# EAGLE design au6850_mp3 (EAGLE 7.6.0)
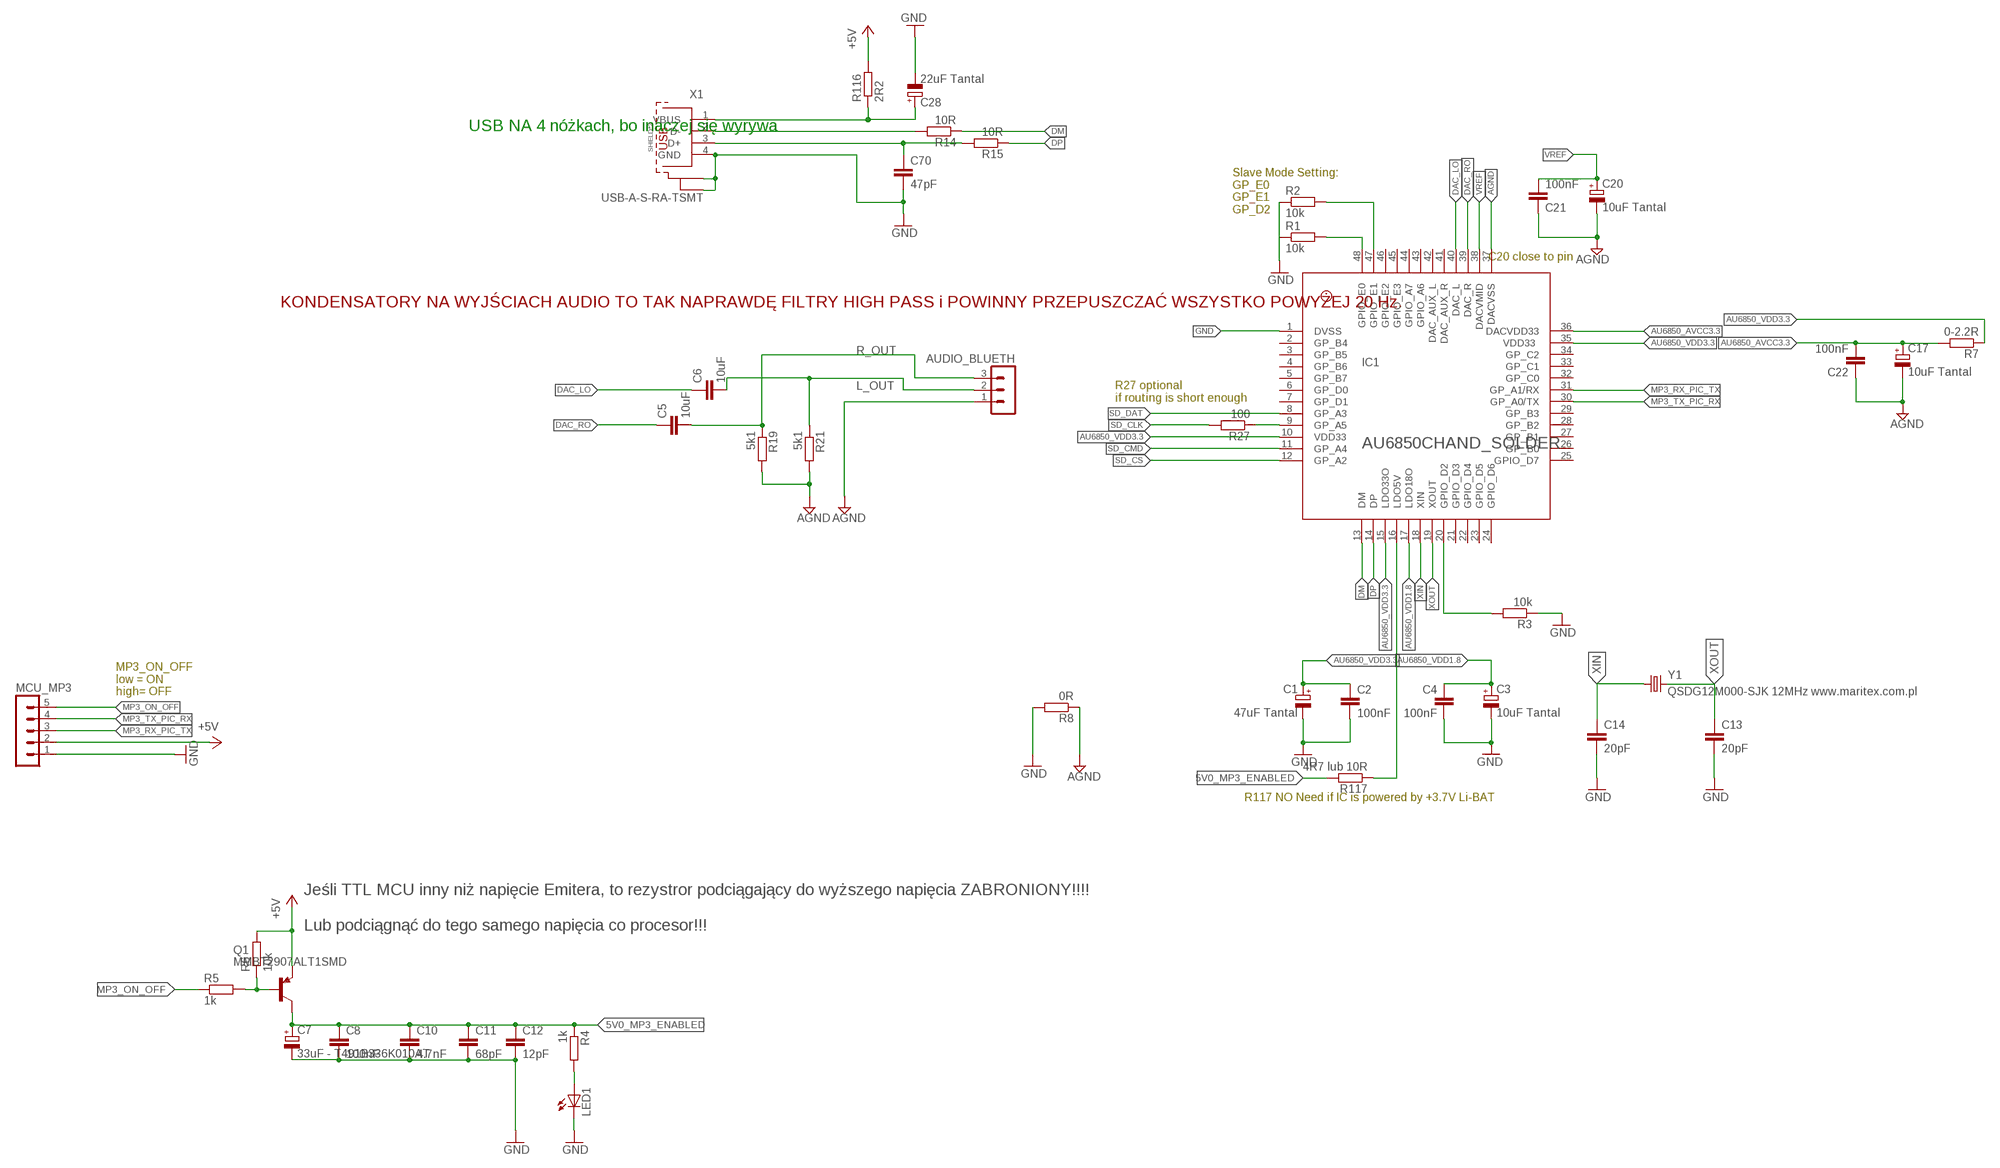
[diagram p0: schematic, sheet 1, part 1 of 2]
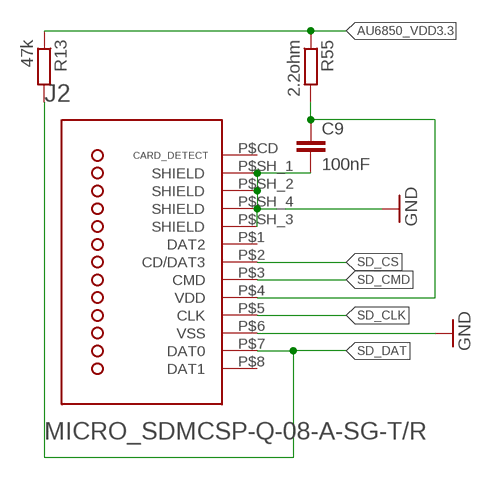
[diagram p1: schematic, sheet 1, part 2 of 2]

## Parts
AUDIO_BLUETH  MA03-1  [MA03-1]
C1  47uF Tantal  CPOL-EUB/3528-21R  [B/3528-21R]
C2  100nF  C-EUC0805  [C0805]
C3  10uF Tantal  CPOL-EUB/3528-21R  [B/3528-21R]
C4  100nF  C-EUC0805  [C0805]
C5  10uF  C-EUC0805  [C0805]
C6  10uF  C-EUC0805  [C0805]
C7  33uF - T491B336K010AT  CPOL-EUSMCB  [SMC_B]
C8  100nF  C-EUC0805  [C0805]
C9  100nF  C-EUC0805  [C0805]
C10  4.7nF  C-EUC0805  [C0805]
C11  68pF  C-EUC0805  [C0805]
C12  12pF  C-EUC0603K  [C0603K]
C13  20pF  C-EUC0805  [C0805]
C14  20pF  C-EUC0805  [C0805]
C17  10uF Tantal  CPOL-EUB/3528-21R  [B/3528-21R]
C20  10uF Tantal  CPOL-EUB/3528-21R  [B/3528-21R]
C21  100nF  C-EUC0805  [C0805]
C22  100nF  C-EUC0805  [C0805]
C28  22uF Tantal  CPOL-EUSMCB  [SMC_B]
C70  47pF  C-EUC0805  [C0805]
IC1  AU6850CHAND_SOLDER  [LQFP48-7X7_3MM]
J2  MICRO_SDMCSP-Q-08-A-SG-T/R  [MICRO_SD_8PINS]
LED1  LED3MM  [LED3MM]
MCU_MP3  MA05-1  [MA05-1]
Q1  MMBT2907ALT1SMD  [SOT23-BEC]
R1  10k  R-EU_R0805  [R0805]
R2  10k  R-EU_R0805  [R0805]
R3  10k  R-EU_R0805  [R0805]
R4  1k  R-EU_M0805  [M0805]
R5  1k  R-EU_M0805  [M0805]
R6  10k  R-EU_M0805  [M0805]
R7  0-2.2R  R-EU_R0805  [R0805]
R8  0R  R-EU_R0805  [R0805]
R13  47k  R-EU_R0805  [R0805]
R14  10R  R-EU_R0805  [R0805]
R15  10R  R-EU_R0805  [R0805]
R19  5k1  R-EU_R0805  [R0805]
R21  5k1  R-EU_R0805  [R0805]
R27  100  R-EU_R0805  [R0805]
R55  2.2ohm  R-EU_R0805  [R0805]
R116  2R2  R-EU_R0805  [R0805]
R117  4R7 lub 10R  R-EU_R0805  [R0805]
X1  USB-A-S-RA-TSMT  [USB-A-S-RA-TSMT]
Y1  QSDG12M000-SJK 12MHz www.maritex.com.pl  CRYSTALSMD  [HC49UP]

## Nets
5V0_MP3_ENABLED: C7.+ C8.1 C10.1 C11.1 C12.1 Q1.C R4.1 R117.2
+5V: MCU_MP3.2 Q1.E R6.2 R116.2
AGND: AUDIO_BLUETH.1 C17.- C20.- C21.1 C22.1 IC1.37(DACVSS) R8.1 R19.2 R21.2
AU6850_AVCC3.3: C17.+ C22.2 IC1.36(DACVDD33) R7.2
AU6850_VDD1.8: C3.+ C4.1 IC1.17(LDO18O)
AU6850_VDD3.3: C1.+ C2.1 IC1.10(VDD33) IC1.15(LDO33O) IC1.35(VDD33) R7.1 R13.1 R55.1
DAC_LO: C6.1 IC1.40(DAC_L)
DAC_RO: C5.1 IC1.39(DAC_R)
DM: IC1.13(DM) R14.1
DP: IC1.14(DP) R15.1
GND: C1.- C2.2 C3.- C4.2 C7.- C8.2 C9.2 C10.2 C11.2 C12.2 C13.2 C14.2 C28.- C70.2 IC1.1(DVSS) J2.P$6(VSS) J2.P$SH_1(1_GND_PAD) J2.P$SH_2(2_GND_PAD) J2.P$SH_3(3_GND_PAD) J2.P$SH_4(4_GND_PAD) LED1.K(C) MCU_MP3.1 R1.1 R2.1 R3.1 R8.2 X1.4(GND) X1.5(SH1) X1.6(SH2)
L_OUT: AUDIO_BLUETH.2 C6.2 R21.1
MP3_ON_OFF: MCU_MP3.5 R5.1
MP3_RX_PIC_TX: IC1.31(GP_A1/RX) MCU_MP3.3
MP3_TX_PIC_RX: IC1.30(GP_A0/TX) MCU_MP3.4
N$1: LED1.A R4.2
N$2: Q1.B R5.2 R6.1
N$4: IC1.16(LDO5V) R117.1
N$5: IC1.9(GP_A5) R27.1
N$8: C28.+ R116.1 X1.1(VBUS)
N$9: C70.1 R15.2 X1.3(D+)
N$10: R14.2 X1.2(D-)
N$14: C9.1 J2.P$4(VDD) R55.2
R_OUT: AUDIO_BLUETH.3 C5.2 R19.1
SD_CLK: J2.P$5(CLK) R27.2
SD_CMD: IC1.11(GP_A4) J2.P$3(CMD)
SD_CS: IC1.12(GP_A2) J2.P$2(CD/DAT3)
SD_DAT: IC1.8(GP_A3) J2.P$7(DAT0) R13.2
SLAVE_D2: IC1.20(GPIO_D2) R3.2
SLAVE_E0: IC1.48(GPIO_E0) R1.2
SLAVE_E1: IC1.47(GPIO_E1) R2.2
VREF: C20.+ C21.2 IC1.38(DACVMID)
XIN: C14.1 IC1.18(XIN) Y1.1
XOUT: C13.1 IC1.19(XOUT) Y1.2
Unconnected: IC1.2(GP_B4) IC1.3(GP_B5) IC1.4(GP_B6) IC1.5(GP_B7) IC1.6(GP_D0) IC1.7(GP_D1) IC1.21(GPIO_D3) IC1.22(GPIO_D4) IC1.23(GPIO_D5) IC1.24(GPIO_D6) IC1.25(GPIO_D7) IC1.26(GP_B0) IC1.27(GP_B1) IC1.28(GP_B2) IC1.29(GP_B3) IC1.32(GP_C0) IC1.33(GP_C1) IC1.34(GP_C2) IC1.41(DAC_AUX_R) IC1.42(DAC_AUX_L) IC1.43(GPIO_A6) IC1.44(GPIO_A7) IC1.45(GPIO_E3) IC1.46(GPIO_E2) J2.P$1(DAT2) J2.P$8(DAT1) J2.P$CD(CARD_DETECT_SW)

## Notes on the sheet
- USB NA 4 nóżkach, bo inaczej się wyrywa
- Slave Mode Setting:
  GP_E0
  GP_E1
  GP_D2
- C20 close to pin
- KONDENSATORY NA WYJŚCIACH AUDIO TO TAK NAPRAWDĘ FILTRY HIGH PASS i POWINNY PRZEPUSZCZAĆ WSZYSTKO POWYŻEJ 20 Hz.
- R27 optional
  if routing is short enough
- MP3_ON_OFF
  low = ON
  high= OFF
- R117 NO Need if IC is powered by +3.7V Li-BAT
- Jeśli TTL MCU inny niż napięcie Emitera, to rezystror podciągający do wyższego napięcia ZABRONIONY!!!!
  
  Lub podciągnąć do tego samego napięcia co procesor!!!

## Library data of the parts
AUDIO_BLUETH = con-lstb:MA03-1: PIN HEADER; OC_FARNELL: unknown; OC_NEWARK: unknown
C1 = rcl:CPOL-EU: POLARIZED CAPACITOR, European symbol; PARTNUM: TAJB476K010R; SUPPLIER: TME
C2 C4-C6 C21 C22 = rcl:C-EU: CAPACITOR, European symbol
C3 = rcl:CPOL-EU: POLARIZED CAPACITOR, European symbol; PARTNUM: TAJA106K010R; SUPPLIER: TME
C7 = resistor:CPOL-EU: POLARIZED CAPACITOR, European symbol; PARTNUM: TAJB336K010R; SUPPLIER: TME
C8-C14 C70 = resistor:C-EU: CAPACITOR, European symbol
C17 C20 = rcl:CPOL-EU: POLARIZED CAPACITOR, European symbol
C28 = rcl:CPOL-EU: POLARIZED CAPACITOR, European symbol; PARTNUM: TAJB226M010R; SUPPLIER: TME
IC1 = mvsilicon:AU6850C
J2 = ADAM_TECH_SD_Card:MICRO_SD: Adam Tech; PARTNUM: MCSP-Q-08-A-SG-T/R; SUPPLIER: TME
LED1 = led:LED: LED OSRAM: - CHIPLED LG R971, LG N971, LY N971, LG Q971, LY Q971, LO R971, LY R971 LH N974, LH R974 LS Q976, LO Q976, LY Q976 LO Q996 - Hyper CHIPLED LW Q18S LB Q993, LB Q99A, LB R99A - SideLED LS A670, LO A670, LY A670, LG A670, LP A670 LB A673, LV A673, LT A673, LW A673 LH A674 LY A675 LS A676, LA A676, LO A676, LY A676, LW A676 LS A679, LY A679, LG A679 - Hyper Micro SIDELED® LS Y876, LA Y876, LO Y876, LY Y876 LT Y87S - SmartLED LW L88C, LW L88S LB L89C, LB L89S, LG L890 LS L89K, LO L89K, LY L89K LS L896, LA L896, LO L896, LY L896 - TOPLED LS T670, LO T670, LY T670, LG T670, LP T670 LSG T670, LSP T670, LSY T670, LOP T670, LYG T670 LG T671, LOG T671, LSG T671 LB T673, LV T673, LT T673, LW T673 LH T674 LS T676, LA T676, LO T676, LY T676, LB T676, LH T676, LSB T676, LW T676 LB T67C, LV T67C, LT T67C, LS T67K, LO T67K, LY T67K, LW E67C LS E67B, LA E67B, LO E67B, LY E67B, LB E67C, LV E67C, LT E67C LW T67C LS T679, LY T679, LG T679 LS T770, LO T770, LY T770, LG T770, LP T770 LB T773, LV T773, LT T773, LW T773 LH T774 LS E675, LA E675, LY E675, LS T675 LS T776, LA T776, LO T776, LY T776, LB T776 LHGB T686 LT T68C, LB T68C - Hyper Mini TOPLED® LB M676 - Mini TOPLED Santana® LG M470 LS M47K, LO M47K, LY M47K Source: http://www.osram.convergy.de LUXEON: - LUMILED® LXK2-PW12-R00, LXK2-PW12-S00, LXK2-PW14-U00, LXK2-PW14-V00 LXK2-PM12-R00, LXK2-PM12-S00, LXK2-PM14-U00 LXK2-PE12-Q00, LXK2-PE12-R00, LXK2-PE12-S00, LXK2-PE14-T00, LXK2-PE14-U00 LXK2-PB12-K00, LXK2-PB12-L00, LXK2-PB12-M00, LXK2-PB14-N00, LXK2-PB14-P00, LXK2-PB14-Q00 LXK2-PR12-L00, LXK2-PR12-M00, LXK2-PR14-Q00, LXK2-PR14-R00 LXK2-PD12-Q00, LXK2-PD12-R00, LXK2-PD12-S00 LXK2-PH12-R00, LXK2-PH12-S00 LXK2-PL12-P00, LXK2-PL12-Q00, LXK2-PL12-R00 Source: www.luxeon.com KINGBRIGHT: KA-3528ASYC Source: www.kingbright.com
MCU_MP3 = con-lstb:MA05-1: PIN HEADER; OC_FARNELL: unknown; OC_NEWARK: unknown
Q1 = transistor-pnp:MMBT2907*: PNP Transistror
R1-R8 R13-R15 R19 R21 R27 R55 R116 R117 = rcl:R-EU_: RESISTOR, European symbol
X1 = ADAM_TECH_USB-A-S-RA-TSMT:USB-A-S-RA-TSMT: MULTICOMP - USB-A-S-RA-TSMT - USB, 3.0 TYPE A, RECEPTACLE, SMT CUI -UJ2-AH-1-SMT-TR, 3.0 TYPE A, RECEPTACLE, SMT AdamTech - USB-A-S-RA-TSMT - USB, 3.0 TYPE A, RECEPTACLE, SMT Source: Datasheet <http://www.farnell.com/datasheets/1864222.pdf>; DESCRIPTION: MULTICOMP - USB-A-S-RA-TSMT - USB, 3.0 TYPE A, RECEPTACLE, SMT; HEIGHT: mm; MANUFACTURER_NAME: MULTICOMP; MANUFACTURER_PART_NUMBER: USB-A-S-RA-TSMT
Y1 = SparkFun-FreqCtrl:CRYSTAL: Various standard crystals. Proven footprints. Spark Fun Electronics SKU : COM-00534; PARTNUM: 12.00M-SMDHC49S; SUPPLIER: TME

## Board
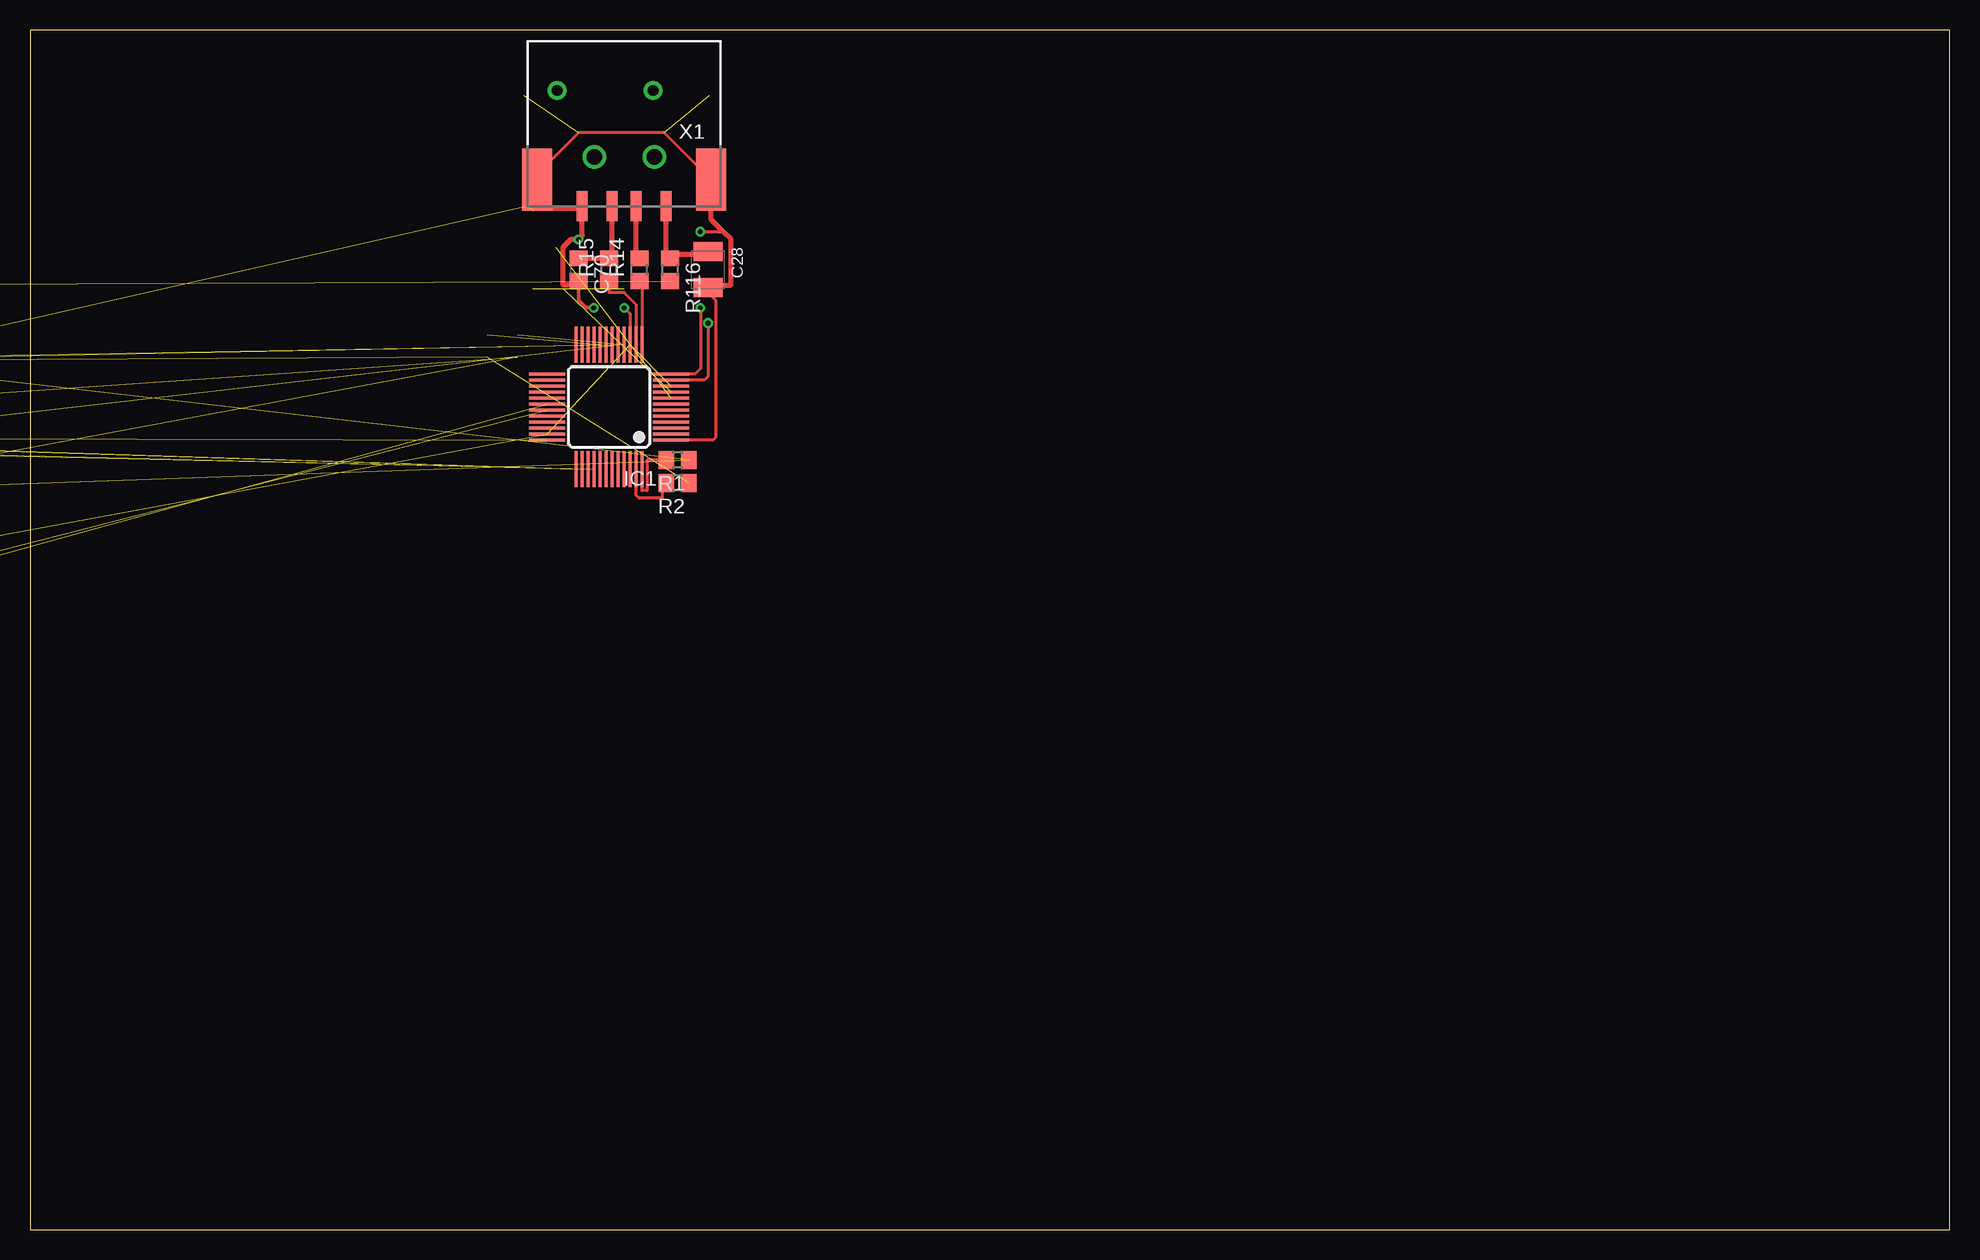
[diagram p2: board, top side]
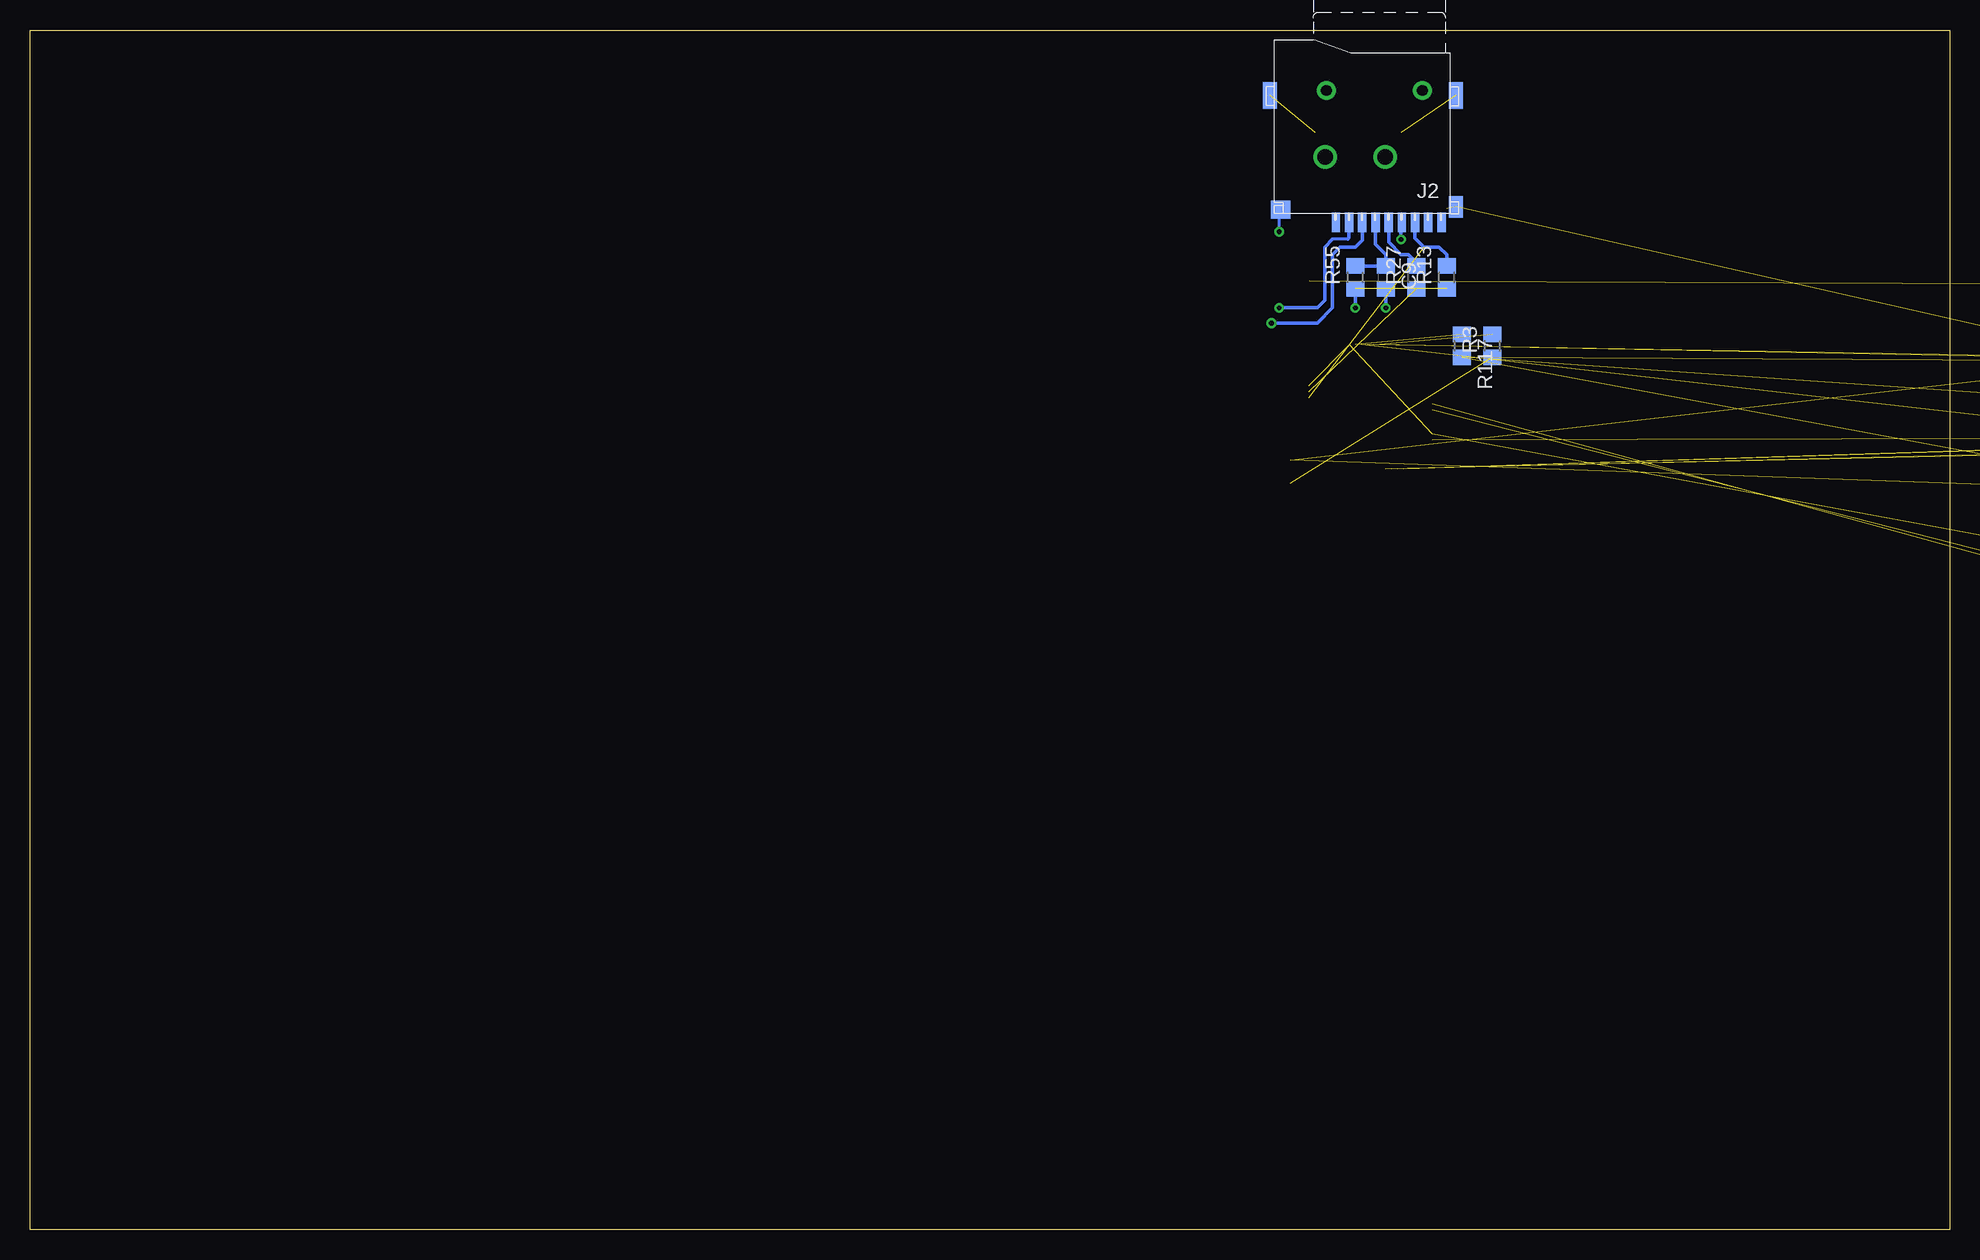
[diagram p3: board, bottom side, seen from below]

Size 160 x 100 mm. Coordinates in mm from the lower left corner, seen from the top.
Outline: 0,0 160,0 160,100 0,100 0,0
Copper layers (1*16): Top 0.035mm / dielectric 1.5mm / Bottom 0.035mm
Design rules "default": minimum track width 10mil, minimum drill 24mil, track to track 8mil, track to pad 8mil, pad to pad 8mil, via to via 8mil, smd to smd 8mil, copper to edge 40mil, drill to drill 8mil, minimum pad ring 10mil, minimum via ring 8mil, stop-mask expansion 4mil, vias tented up to drill 0mil, thermal gap 10mil

### Footprints (pad centres in the part's own frame; a part is rotated, then mirrored left to right if it is on the bottom)
MA03-1 = drill 1.016 long: 1 -2.54,0; 2 0,0; 3 2.54,0
B/3528-21R = smd 1.95 x 2.5: + 1.525,0; - -1.525,0
C0805 = smd 1.3 x 1.5: 1 -0.95,0; 2 0.95,0
SMC_B = smd 1.6 x 2.4: + -1.5,0; - 1.5,0
C0603K = smd 1.05 x 1.08: 1 -0.875,0; 2 0.875,0
LQFP48-7X7_3MM = smd 3 x 0.254: 1 -5.175,2.75; 2 -5.175,2.25; 3 -5.175,1.75; 4 -5.175,1.25; 5 -5.175,0.75; 6 -5.175,0.25; 7 -5.175,-0.25; 8 -5.175,-0.75; 9 -5.175,-1.25; 10 -5.175,-1.75; 11 -5.175,-2.25; 12 -5.175,-2.75; 25 5.175,-2.75; 26 5.175,-2.25; 27 5.175,-1.75; 28 5.175,-1.25; 29 5.175,-0.75; 30 5.175,-0.25; 31 5.175,0.25; 32 5.175,0.75; 33 5.175,1.25; 34 5.175,1.75; 35 5.175,2.25; 36 5.175,2.75 | smd 0.254 x 3: 13 -2.75,-5.175; 14 -2.25,-5.175; 15 -1.75,-5.175; 16 -1.25,-5.175; 17 -0.75,-5.175; 18 -0.25,-5.175; 19 0.25,-5.175; 20 0.75,-5.175; 21 1.25,-5.175; 22 1.75,-5.175; 23 2.25,-5.175; 24 2.75,-5.175; 37 2.75,5.175; 38 2.25,5.175; 39 1.75,5.175; 40 1.25,5.175; 41 0.75,5.175; 42 0.25,5.175; 43 -0.25,5.175; 44 -0.75,5.175; 45 -1.25,5.175; 46 -1.75,5.175; 47 -2.25,5.175; 48 -2.75,5.175
MICRO_SD_8PINS = drill 0.9 pad 1.575: 1 -4.95,-10.5; 15 3.05,-10.5 | smd 0.7 x 1.6: P$1 2.25,0.5; P$2 1.15,0.5; P$3 0.05,0.5; P$4 -1.05,0.5; P$5 -2.15,0.5; P$6 -3.25,0.5; P$7 -4.35,0.5; P$8 -5.45,0.5; P$CD -6.55,0.5 | smd 1.2 x 2.2: P$SH_1 -7.75,-10.1; P$SH_2 7.75,-10.1 | smd 1.2 x 1.8: P$SH_3 -7.75,-0.8 | smd 1.6 x 1.5: P$SH_4 6.85,-0.55
LED3MM = drill 0.813 octagon: A -1.27,0; K 1.27,0
MA05-1 = drill 1.016 long: 1 -5.08,0; 2 -2.54,0; 3 0,0; 4 2.54,0; 5 5.08,0
SOT23-BEC = smd 1 x 1.4: B -0.95,-1.1; C 0,1.1; E 0.95,-1.1
R0805 = smd 1.3 x 1.5: 1 -0.95,0; 2 0.95,0
M0805 = smd 1.3 x 1.6: 1 -0.95,0; 2 0.95,0
USB-A-S-RA-TSMT = smd 0.9 x 2.5: 1 -3.5,13.75; 2 -1,13.75; 3 1,13.75; 4 3.5,13.75 | smd 2.5 x 5.15: 5 -7.25,11.55; 6 7.25,11.55 | drill 1.3 pad 1.95: 7 -2.5,9.65; 8 2.5,9.65
HC49UP = smd 5.334 x 1.93: 1 -4.826,0; 2 4.826,0

### Placement (x,y rotation side)
AUDIO_BLUETH  -54.61,77.47 0 top  (outside the outline)
C1  -35.56,52.07 0 top  (outside the outline)
C2  -72.39,59.69 0 top  (outside the outline)
C3  -46.99,52.07 0 top  (outside the outline)
C4  -17.78,66.04 0 top  (outside the outline)
C5  -62.23,66.04 0 top  (outside the outline)
C6  -68.58,66.04 0 top  (outside the outline)
C7  -27.94,59.69 0 top  (outside the outline)
C8  -24.13,66.04 0 top  (outside the outline)
C9  46.99,79.38 270 bottom
C10  -55.88,66.04 0 top  (outside the outline)
C11  -16.51,72.39 0 top  (outside the outline)
C12  -72.39,78.74 0 top  (outside the outline)
C13  -22.86,72.39 0 top  (outside the outline)
C14  -29.21,72.39 0 top  (outside the outline)
C17  -58.42,52.07 0 top  (outside the outline)
C20  -69.85,52.07 0 top  (outside the outline)
C21  -36.83,66.04 0 top  (outside the outline)
C22  -43.18,66.04 0 top  (outside the outline)
C28  56.52,80.01 270 top
C70  45.72,80.01 270 top
IC1  48.26,68.58 180 top
J2  48.9,84.45 180 bottom
LED1  -67.31,78.74 0 top  (outside the outline)
MCU_MP3  -20.32,52.07 0 top  (outside the outline)
Q1  -68.58,41.91 0 top  (outside the outline)
R1  53.98,64.14 180 top
R2  53.98,62.23 180 top
R3  38.1,73.66 90 bottom
R4  -31.75,78.74 0 top  (outside the outline)
R5  -36.83,78.74 0 top  (outside the outline)
R6  -26.67,78.74 0 top  (outside the outline)
R7  -66.04,59.69 0 top  (outside the outline)
R8  -41.91,78.74 0 top  (outside the outline)
R13  41.91,79.38 90 bottom
R14  50.8,80.01 90 top
R15  48.26,80.01 90 top
R19  -55.88,72.39 0 top  (outside the outline)
R21  -60.96,72.39 0 top  (outside the outline)
R27  44.45,79.38 90 bottom
R55  49.53,79.38 90 bottom
R116  53.34,80.01 270 top
R117  40.64,73.66 270 bottom
X1  49.53,99.06 180 top
Y1  -45.72,43.18 0 top  (outside the outline)

### Tracks (layer width: path | path; a pad name or v marks a point on that pad's centre or on a via)
5V0_MP3_ENABLED  (7 unrouted)
+5V  (3 unrouted)
AGND  (8 unrouted)
AU6850_AVCC3.3  (3 unrouted)
AU6850_VDD1.8  (2 unrouted)
AU6850_VDD3.3  (via drill 0.4)  (6 unrouted)
  Top 0.254: v49.53,76.83 50.01,76.36 IC1.15
  Bottom 0.305: R55.1 v49.53,76.83
DAC_LO  (1 unrouted)
DAC_RO  (1 unrouted)
DM
  Top 0.254: R14.1 51.01,79.06 IC1.13
DP
  Top 0.254: R15.1 48.26,78.11 49.53,78.11 50.51,77.12 IC1.14
GND  (via drill 0.4)  (20 unrouted)
  Top 0.254: IC1.1 56.94,65.83 57.15,66.04 57.15,77.47 56.52,78.11 C28.- | v55.88,83.19 57.78,83.19 | X1.5 52.85,91.44 45.72,91.44 42.28,88 X1.6
  Top 0.305: C70.2 45.72,77.47 46.35,76.83 v46.99,76.83
  Top 0.406: C70.2 45.4,78.74 44.45,78.74 44.45,81.92 45.09,82.55 v45.72,82.55 46.03,82.86 X1.4 45.81,85.09 41.91,85.09 42.28,85.46 X1.6 | C28.- 56.74,78.74 58.42,78.74 58.42,82.55 57.78,83.19 56.78,84.19 X1.5
  Bottom 0.254: J2.P$SH_4 55.88,84.87 v55.88,83.19
  Bottom 0.305: J2.P$6 45.72,83.88 v45.72,82.55 | C9.2 v46.99,76.83
L_OUT  (2 unrouted)
MP3_ON_OFF  (1 unrouted)
MP3_RX_PIC_TX  (1 unrouted)
MP3_TX_PIC_RX  (1 unrouted)
N$1  (1 unrouted)
N$2  (2 unrouted)
N$4  (1 unrouted)
N$5  (1 unrouted)
N$8
  Top 0.406: X1.1 53.03,81.27 R116.1 53.34,81.28 56.28,81.28 C28.+
N$9
  Top 0.406: X1.3 48.53,81.23 R15.2 C70.1
N$10
  Top 0.406: R14.2 50.53,81.23 X1.2
N$14
  Bottom 0.305: R55.2 C9.1 46.99,81.28 47.84,82.14 J2.P$4
R_OUT  (2 unrouted)
SD_CLK
  Bottom 0.305: J2.P$5 46.74,82.31 45.72,81.28 45.09,81.28 44.45,80.64 R27.2
SD_CMD  (via drill 0.4)
  Top 0.254: v56.52,75.56 56.52,71.12 56.23,70.83 IC1.11
  Bottom 0.305: J2.P$3 48.95,82.5 49.53,81.92 50.8,81.92 51.44,81.28 51.44,76.83 52.7,75.56 v56.52,75.56
SD_CS  (via drill 0.4)
  Top 0.254: v55.88,76.83 55.88,71.75 55.45,71.33 IC1.12
  Bottom 0.254: 50.16,82.55 51.44,82.55
  Bottom 0.305: J2.P$2 50.05,82.67 50.16,82.55 | 51.44,82.55 52.07,81.92 52.07,77.47 52.7,76.83 v55.88,76.83
SD_DAT  (1 unrouted)
  Bottom 0.305: R13.2 41.91,81.28 42.55,81.92 43.81,81.92 44.55,82.64 J2.P$7
SLAVE_D2  (1 unrouted)
SLAVE_E0
  Top 0.254: R1.2 51.44,64.14 51.44,61.59 51.01,61.59 IC1.48
SLAVE_E1
  Top 0.254: R2.2 52.7,62.23 52.7,60.96 50.8,60.96 50.51,61.25 IC1.47
VREF  (2 unrouted)
XIN  (2 unrouted)
XOUT  (2 unrouted)